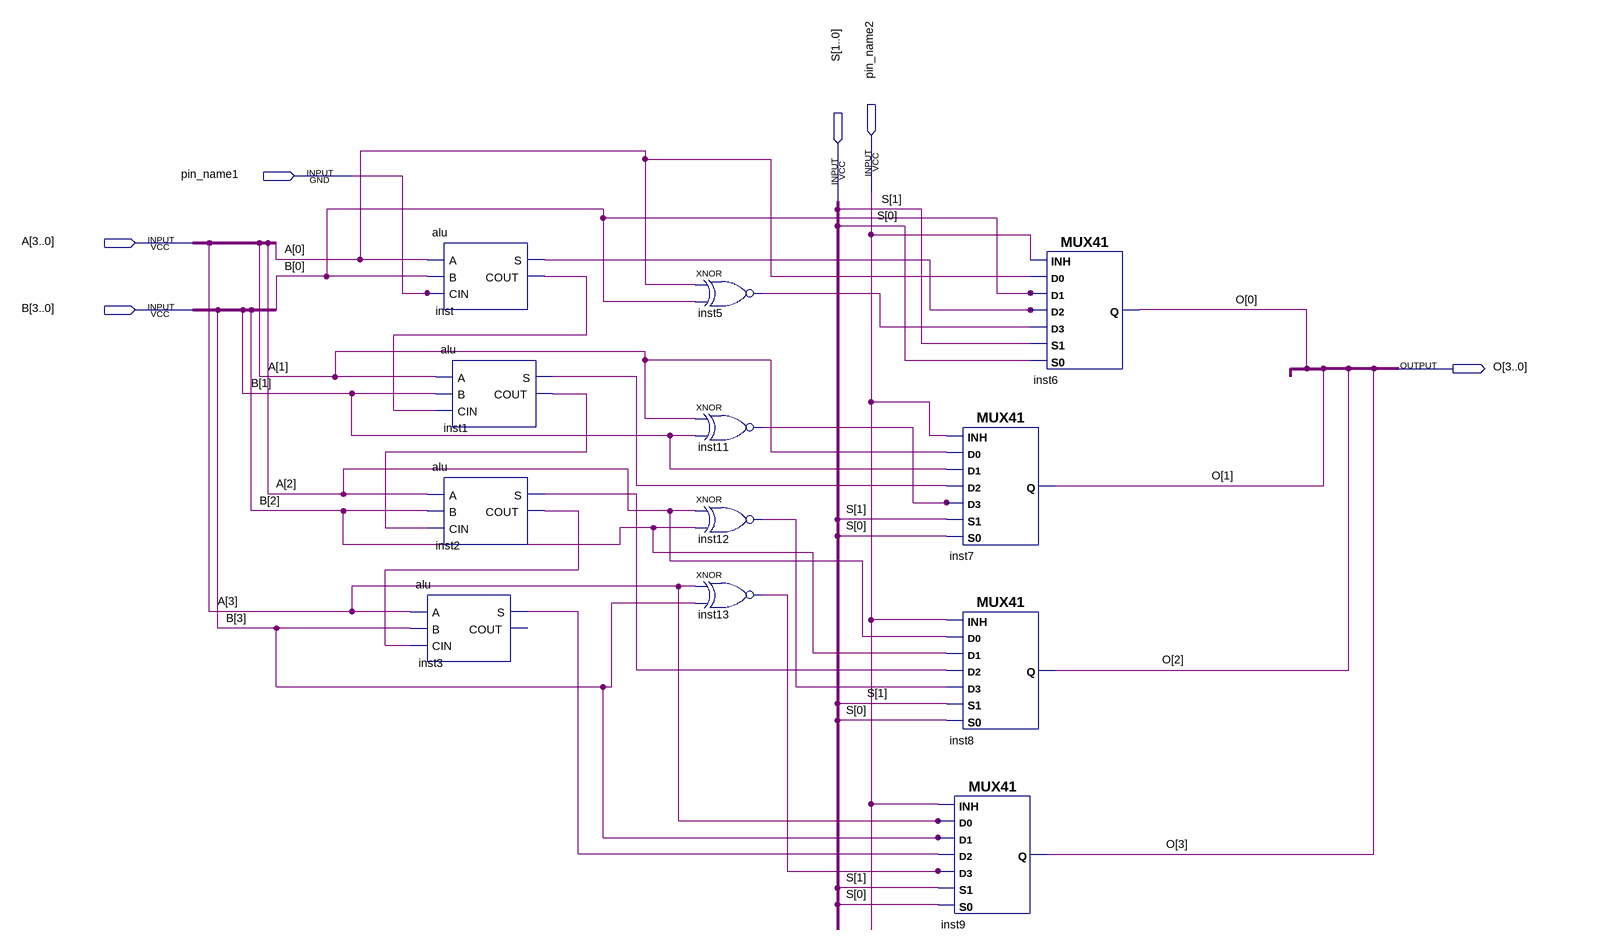
[diagram p0: schematic sheet]
// Quartus schematic Block2.bdf as structural Verilog: 12 symbols, 6 pins
module Block2 (
  input  pin_name1,
  input  pin_name2,
  input  [1:0] S,
  input  [3:0] A,
  input  [3:0] B,
  output [3:0] O
);

  wire inst1_cout, inst1_s, inst2_cout, inst2_s, inst3_s, inst5_out, inst11_out, inst12_out, inst13_out,
       inst_cout, inst_s;

  alu inst (.A(A[0]), .B(B[0]), .CIN(pin_name1), .S(inst_s), .COUT(inst_cout));
  alu inst2 (.A(A[2]), .B(B[2]), .CIN(inst1_cout), .S(inst2_s), .COUT(inst2_cout));
  alu inst3 (.A(A[3]), .B(B[3]), .CIN(inst2_cout), .S(inst3_s));  // open: COUT
  alu inst1 (.A(A[1]), .B(B[1]), .CIN(inst_cout), .S(inst1_s), .COUT(inst1_cout));
  xnor inst5 (inst5_out, A[0], B[0]);
  xnor inst11 (inst11_out, A[1], B[1]);
  xnor inst12 (inst12_out, A[2], B[2]);
  xnor inst13 (inst13_out, A[3], B[3]);
  MUX41 inst7 (.S0(S[0]), .D2(inst1_s), .S1(S[1]), .D3(inst11_out), .D0(A[1]), .INH(pin_name2), .D1(B[1]), .Q(O[1]));
  MUX41 inst8 (.S0(S[0]), .D2(inst2_s), .S1(S[1]), .D3(inst12_out), .D0(A[2]), .INH(pin_name2), .D1(B[2]), .Q(O[2]));
  MUX41 inst9 (.S0(S[0]), .D2(inst3_s), .S1(S[1]), .D3(inst13_out), .D0(A[3]), .INH(pin_name2), .D1(B[3]), .Q(O[3]));
  MUX41 inst6 (.S0(S[0]), .D2(inst_s), .S1(S[1]), .D3(inst5_out), .D0(A[0]), .INH(pin_name2), .D1(B[0]), .Q(O[0]));
endmodule
